# Altium project IPG.PrjPcb (part 1 of 13)
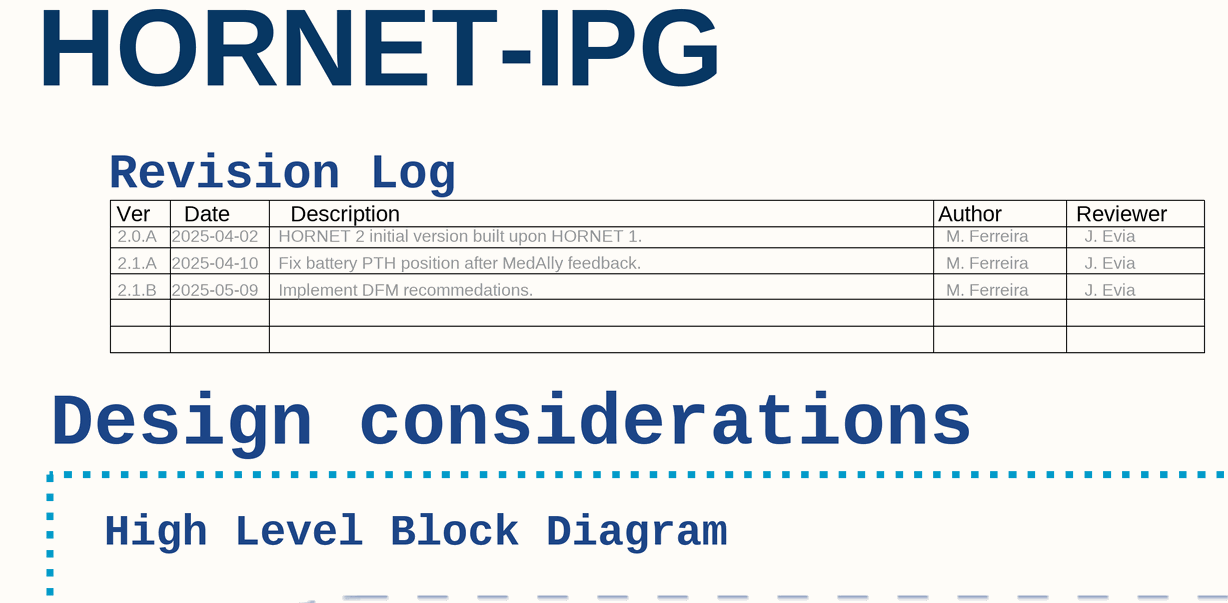
[diagram p0: 01-Cover.SchDoc, top left]
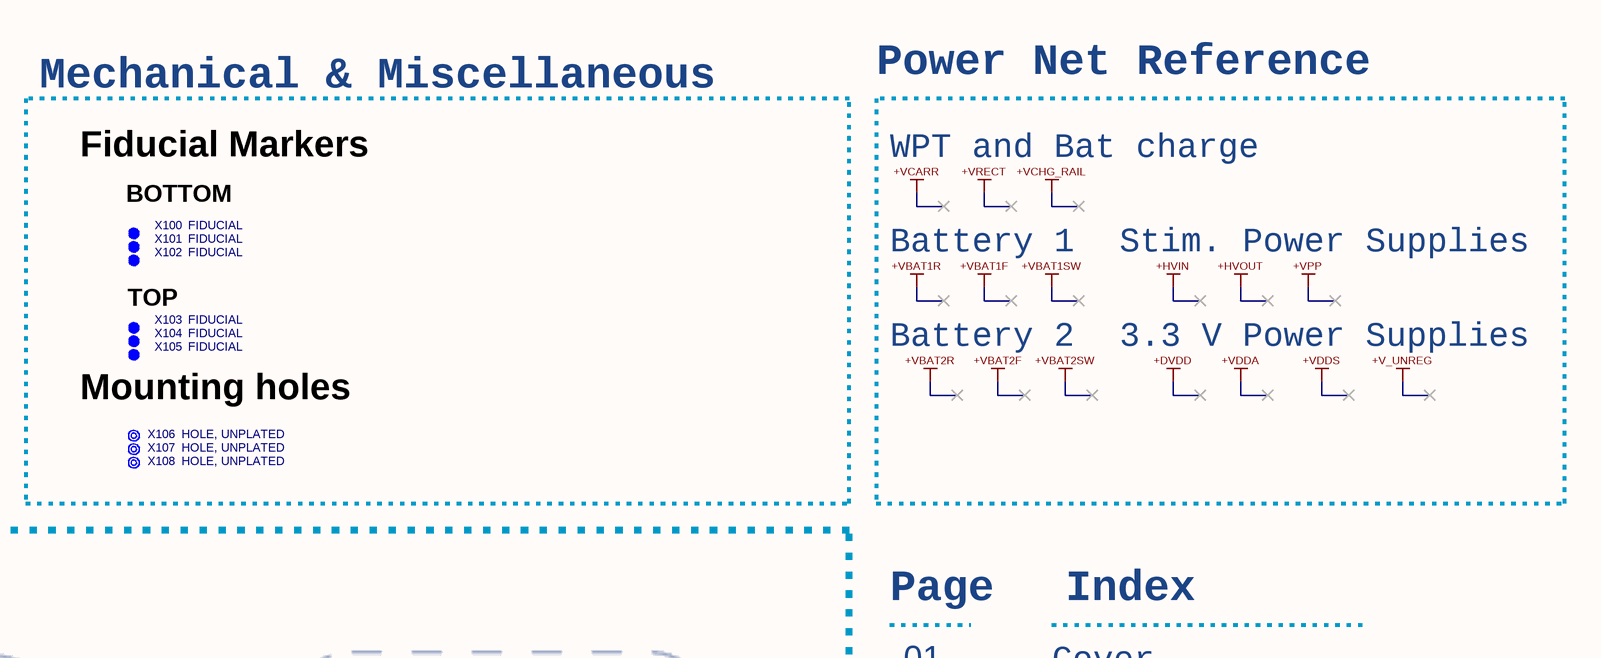
[diagram p1: 01-Cover.SchDoc, top right]
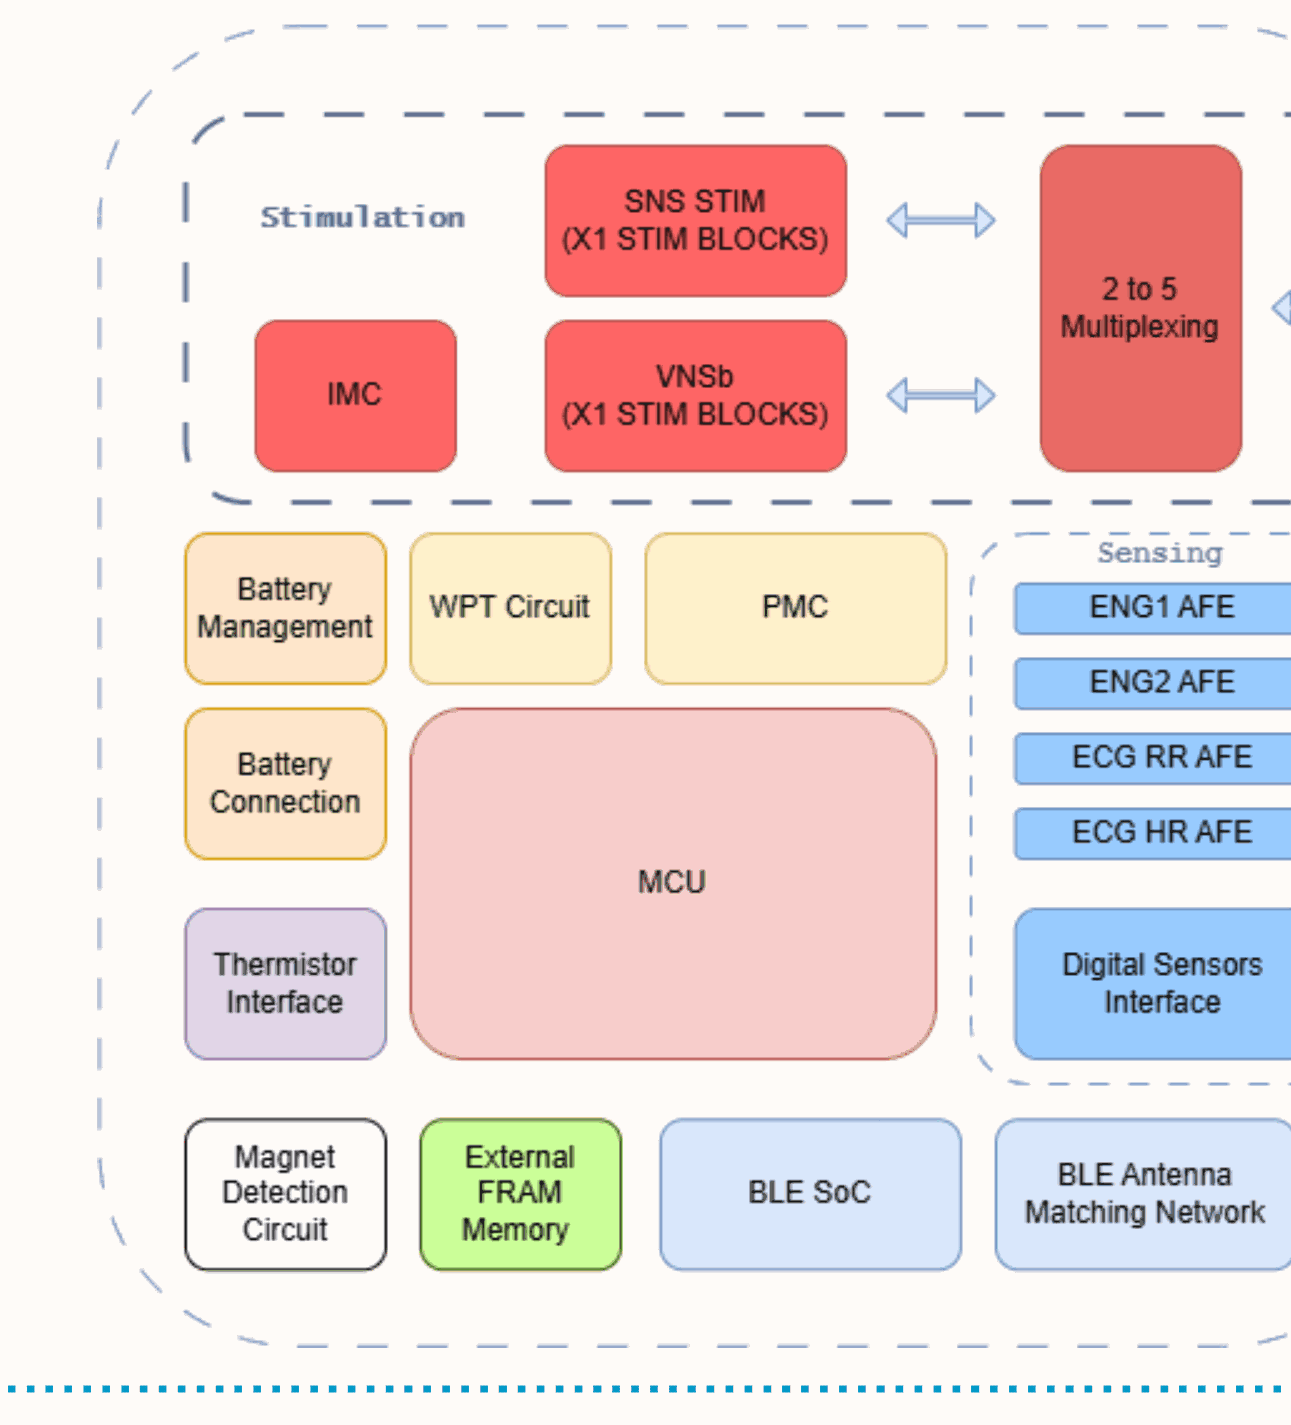
[diagram p2: 01-Cover.SchDoc, bottom left]
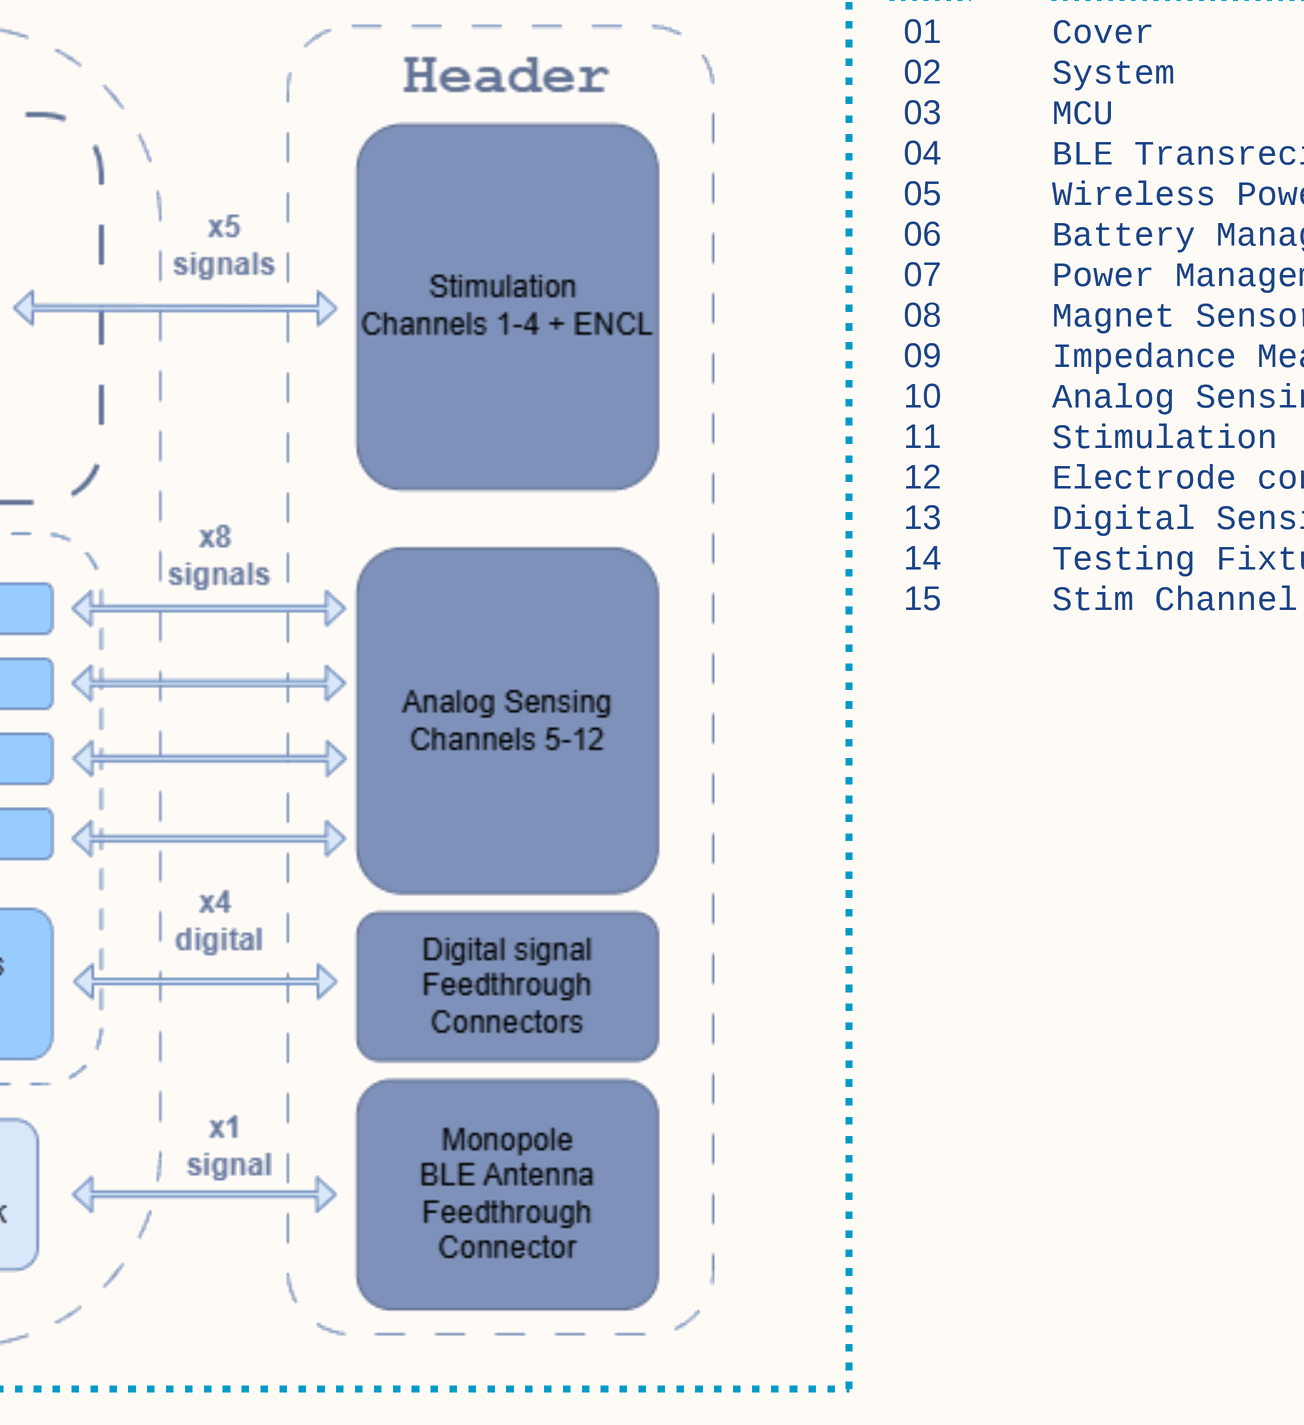
[diagram p3: 01-Cover.SchDoc, bottom right]
15 sheets, 726 parts. Net scope: flat (ports and power ports of the same name join across sheets).
Board files: IPG_Rigid.PcbDoc, IPG.PcbDoc
Sheets:
  01-Cover.SchDoc
    U_System = 02-System.SchDoc
      Battery Management = 06-BatteryManagement.SchDoc
      BLE = 04-BLE.SchDoc
      Electrodes = 12-Electrodes.SchDoc
      IMC = 09-IMC.SchDoc
      Magnet Sensor = 08-MagnetSensor.SchDoc
      STM32 MCU = 03-MCU.SchDoc
      Power Management = 07-PowerManagement.SchDoc
      Sensing = 10-Sensing.SchDoc
      Stimulation = 11-Stimulation.SchDoc
      WPT = 05-WPT.SchDoc
      Digital = 13-Digital.SchDoc
      Test Fixture = 14-TestFixture.SchDoc
      Stim. CH Selection = 15-StimChannelSelection.SchDoc

## Sheet 01-Cover.SchDoc: Cover Page
size A2; DocumentNumber: 1; SheetNumber: 1; SheetTotal: 15

### Parts
X100  FIDUCIAL  [Fid_IPC-7351B]  (no BOM)
X101  FIDUCIAL  [Fid_IPC-7351B]  (no BOM)
X102  FIDUCIAL  [Fid_IPC-7351B]  (no BOM)
X103  FIDUCIAL  [Fid_IPC-7351B]  (no BOM)
X104  FIDUCIAL  [Fid_IPC-7351B]  (no BOM)
X105  FIDUCIAL  [Fid_IPC-7351B]  (no BOM)
X106  HOLE, UNPLATED  [HOLE_UNPLATED_3.5MM]  (no BOM)
X107  HOLE, UNPLATED  [HOLE_UNPLATED_3.5MM]  (no BOM)
X108  HOLE, UNPLATED  [HOLE_UNPLATED_3.5MM]  (no BOM)

### Sub-sheets
U_System = 02-System.SchDoc: no entries

### Notes on the sheet
- Power Net Reference
- Mechanical & Miscellaneous
- HORNET-IPG
- Fiducial Markers
- BOTTOM
- WPT and Bat charge
- Revision Log
- Ver
- Date
- Description
- Author
- Reviewer
- Battery 1
- Stim. Power Supplies
- 2.0.A
- 2.1.A
- 2.1.B
- 2025-04-02
- 2025-04-10
- 2025-05-09
- HORNET 2 initial version built upon HORNET 1.
- Fix battery PTH position after MedAlly feedback.
- Implement DFM recommedations.
- M. Ferreira
- J. Evia
- TOP
- Battery 2
- 3.3 V Power Supplies
- (near X105) Mounting holes
- Design considerations
- High Level Block Diagram
- Page
- Index
- 01
- Cover
- 02
- 03
- System
- MCU
- 04
- BLE Transreciver
- 05
- 06
- Wireless Power Transfer
- Battery Management
- 07
- 08
- Power Management
- Magnet Sensor
- 09
- Impedance Meas. circuit
- 10
- 11
- Analog Sensing
- Stimulation
- 12
- 13
- Electrode connections
- Digital Sensing
- 14
- Testing Fixture
- 15
- Stim Channel Selection
- Project:
- Schematic:
- Design by:
- Date:
- Ver:
- .
- Comments:
- Reviewed by:

### Library data of the parts
X100-X105 = FIDUCIAL: FIDUCIAL_MARK; Manufacturer PN: FIDUCIAL; Status: *; Review: *
X106-X108 = HOLE_UNPLATED: Status: *; Review: *

## Sheet 02-System.SchDoc: System Block Diagram
size A2; DocumentNumber: 2; SheetNumber: 2; SheetTotal: 15
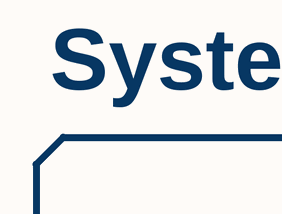
[diagram p4: 02-System.SchDoc, top left]
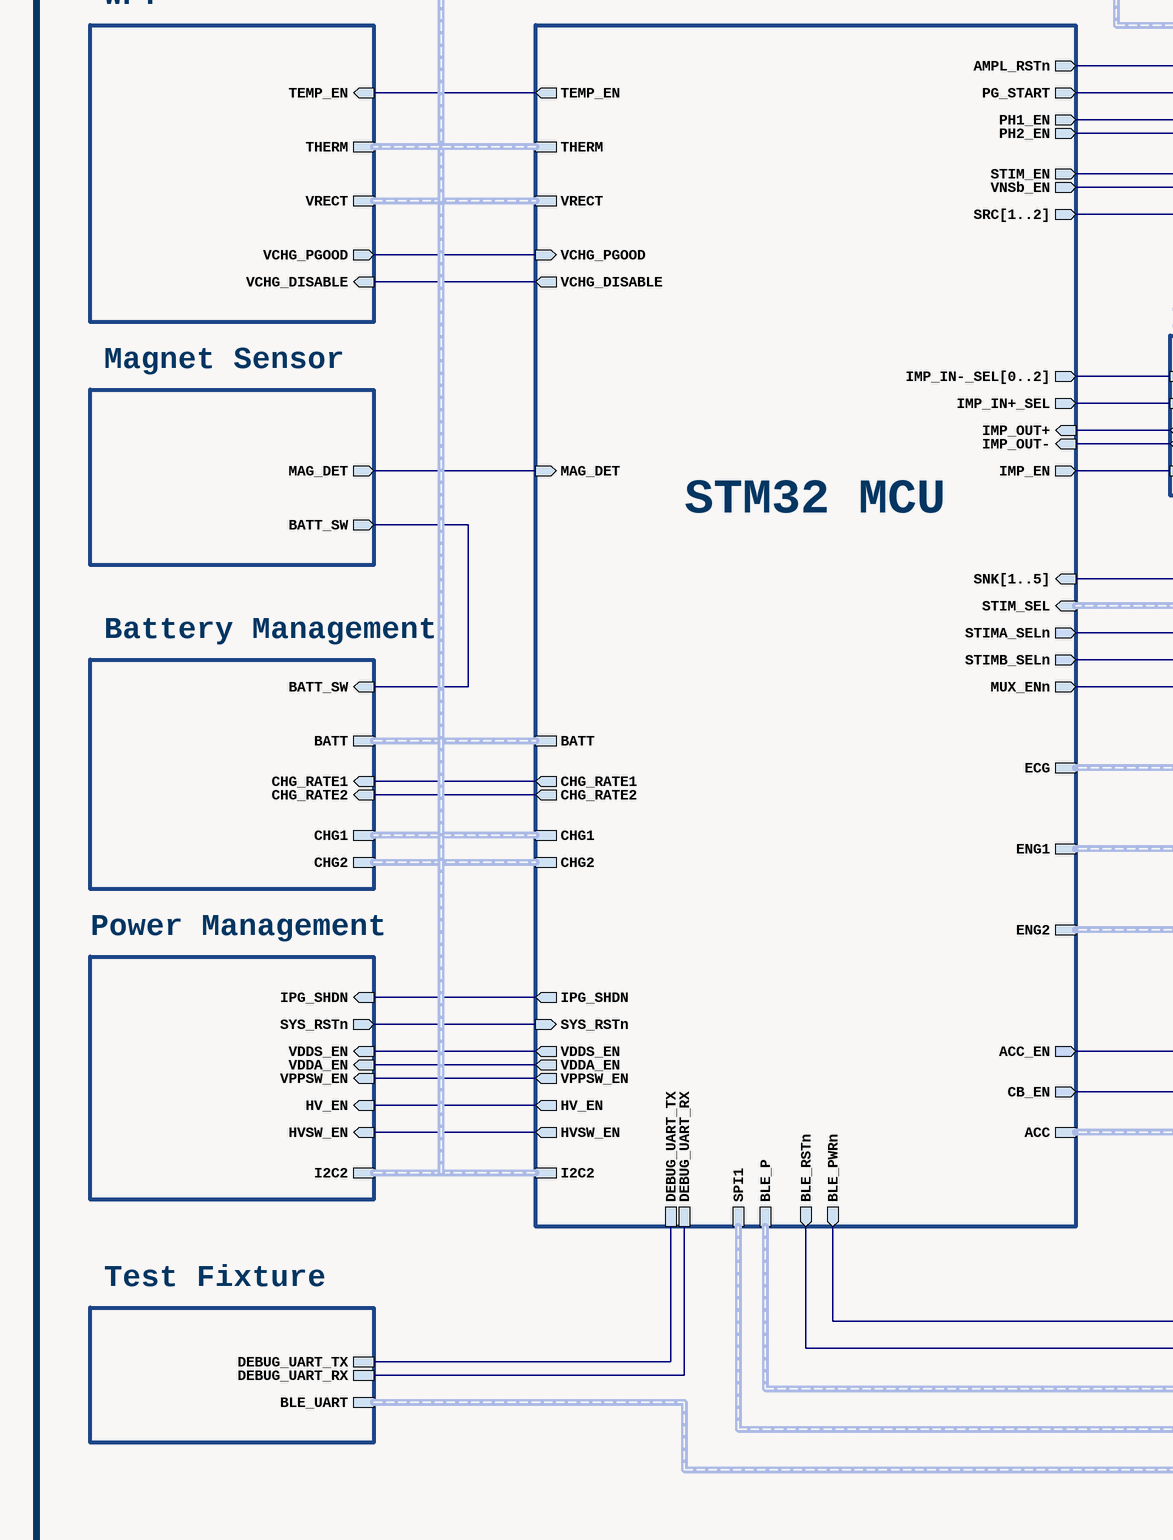
[diagram p5: 02-System.SchDoc, bottom left]
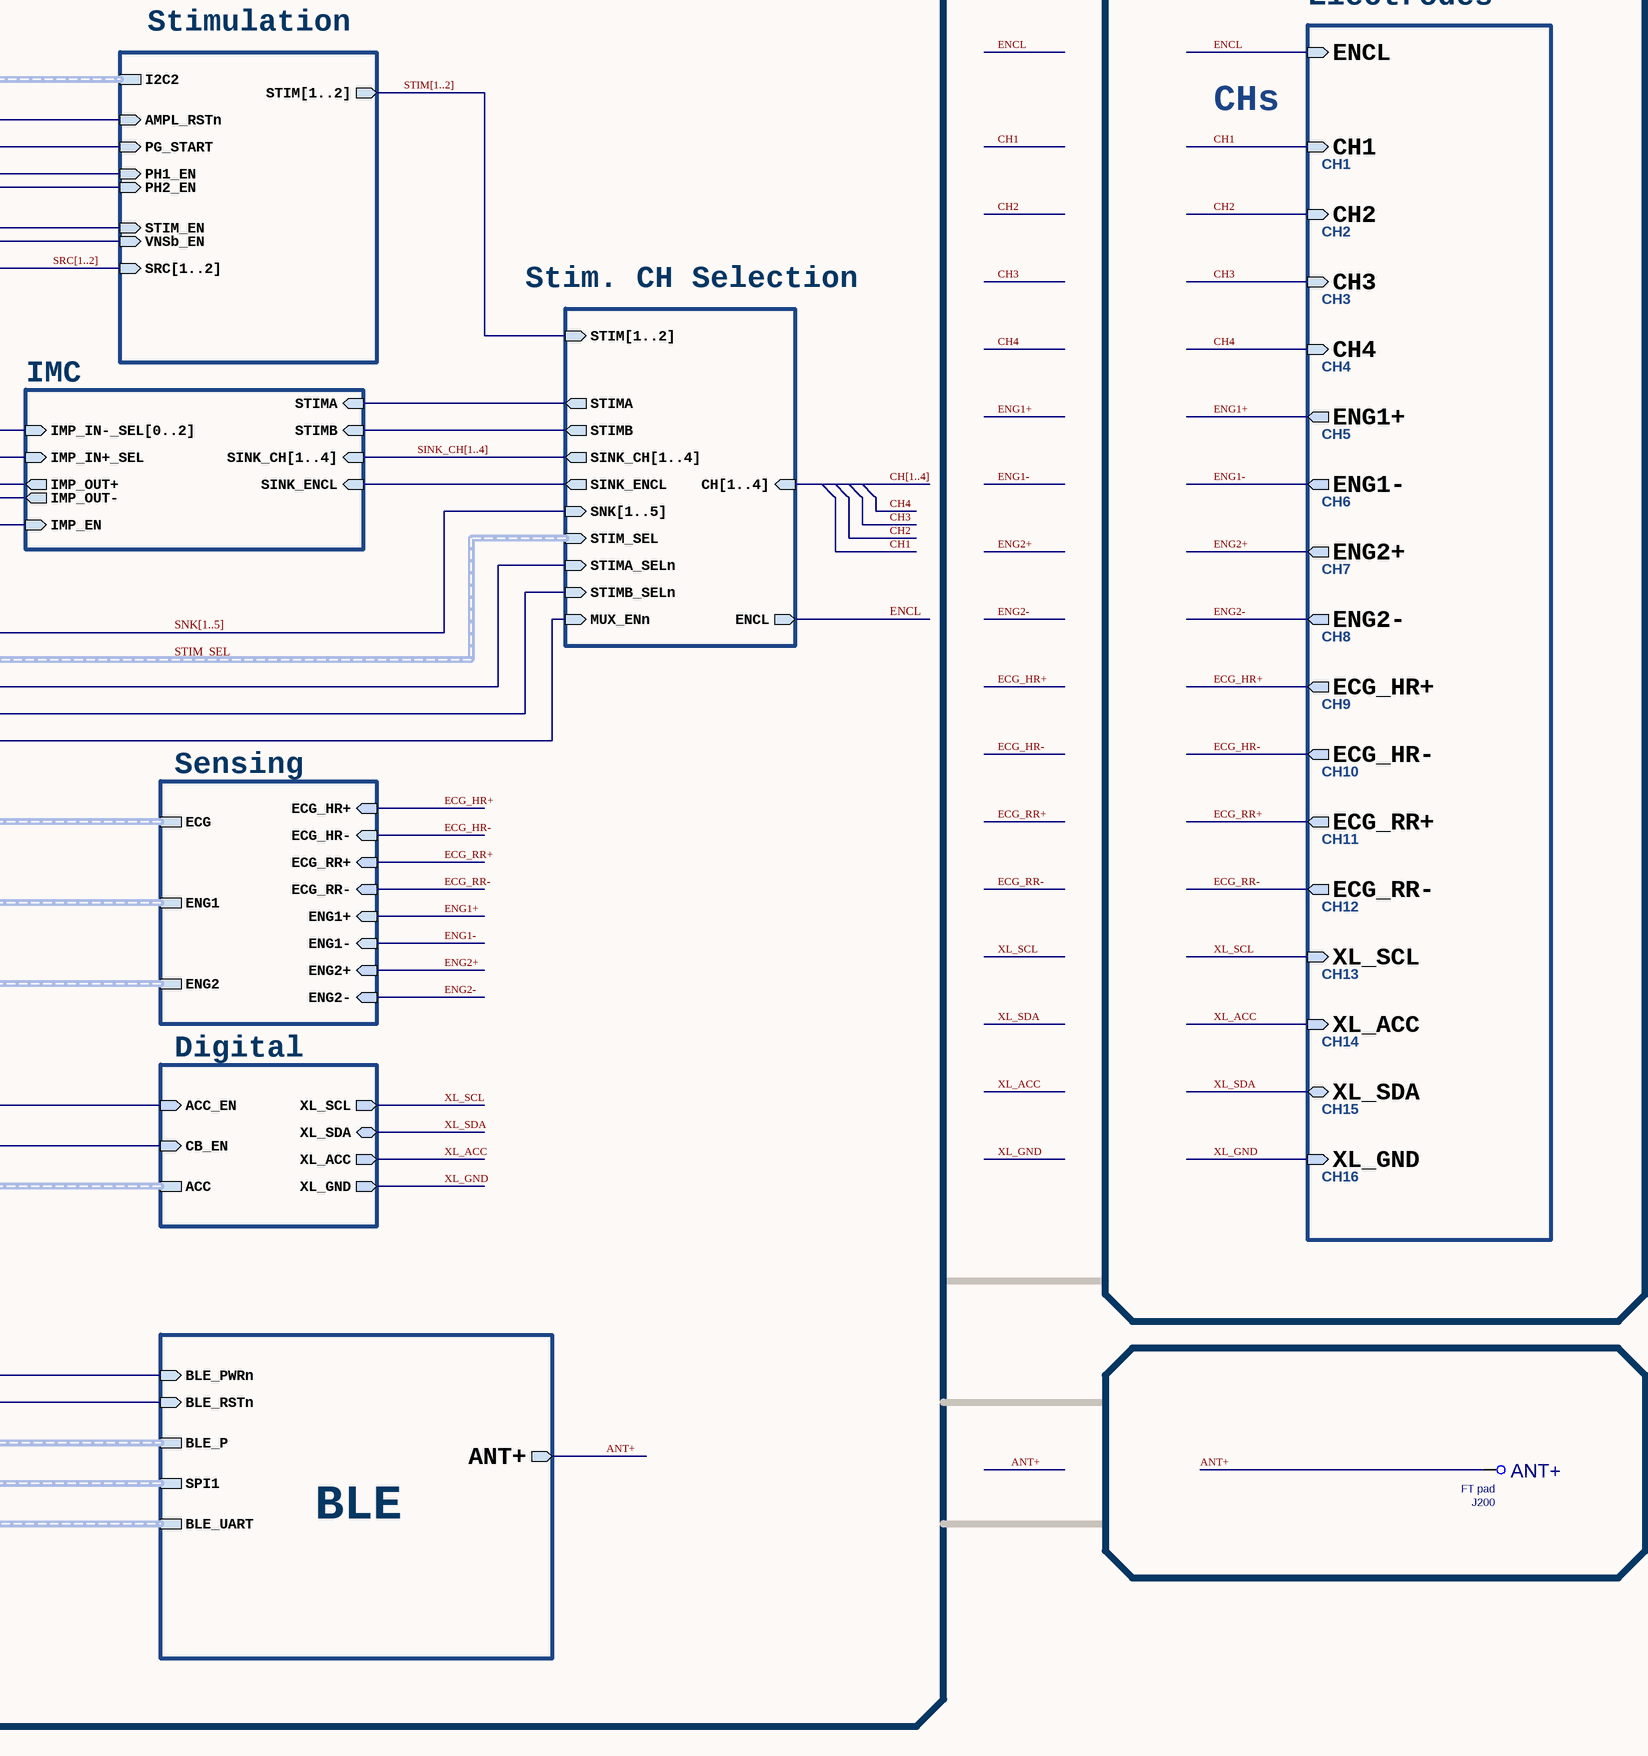
[diagram p6: 02-System.SchDoc, bottom right]

### Parts
J200  value FT pad  [FEEDHOLE_20mil]  (hidden comment: THPAD_20m)  (no BOM)

### Blocks framed on the sheet
ANT+: J200

### Sub-sheets
Battery Management = 06-BatteryManagement.SchDoc: CHG_RATE1 (in), CHG_RATE2 (in), BATT_SW (in), CHG1 (harness CHG_CTRL), CHG2 (harness CHG_CTRL), BATT (harness BATT)
BLE = 04-BLE.SchDoc: BLE_RSTn (in), BLE_PWRn (in), BLE_P (harness BLE PINS), ANT+ (out), SPI1 (harness BLE_SPI), BLE_UART (harness UART)
Digital = 13-Digital.SchDoc: ACC_EN (in), CB_EN (in), ACC (harness I2C), XL_SCL (out), XL_SDA (bidir), XL_ACC (out), XL_GND (out)
Electrodes = 12-Electrodes.SchDoc: CH1 (in), ENCL (in), ENG1+ (out), ENG2+ (out), ENG1- (out), ENG2- (out), ECG_HR+ (out), ECG_RR+ (out), ECG_HR- (out), ECG_RR- (out), XL_SCL (in), XL_SDA (bidir), XL_ACC (in), XL_GND (in), CH2 (in), CH3 (in), CH4 (in)
IMC = 09-IMC.SchDoc: IMP_EN (in), SINK_CH[1..4] (in), SINK_ENCL (in), IMP_IN-_SEL[0..2] (in), IMP_IN+_SEL (in), IMP_OUT- (out), IMP_OUT+ (out), STIMA (in), STIMB (in)
Magnet Sensor = 08-MagnetSensor.SchDoc: MAG_DET (out), BATT_SW (out)
Power Management = 07-PowerManagement.SchDoc: IPG_SHDN (in), SYS_RSTn (out), HVSW_EN (in), HV_EN (in), VPPSW_EN (in), VDDS_EN (in), VDDA_EN (in), I2C2 (harness I2C)
Sensing = 10-Sensing.SchDoc: ENG1+ (in), ENG1- (in), ECG_HR- (in), ENG1 (harness EMG), ECG (harness ECG), ECG_HR+ (in), ENG2 (harness EMG), ECG_RR+ (in), ECG_RR- (in), ENG2+ (in), ENG2- (in)
Stim. CH Selection = 15-StimChannelSelection.SchDoc: STIM[1..2] (in), CH[1..4] (in), ENCL (out), SNK[1..5] (in), STIM_SEL (in, harness STIM_SEL), MUX_ENn (in), STIMB_SELn (in), STIMA_SELn (in), SINK_CH[1..4] (out), SINK_ENCL (out), STIMA (out), STIMB (out)
Stimulation = 11-Stimulation.SchDoc: PG_START (in), AMPL_RSTn (in), PH1_EN (in), PH2_EN (in), STIM_EN (in), SRC[1..2] (in), STIM[1..2] (out), I2C2 (harness I2C), VNSb_EN (in)
STM32 MCU = 03-MCU.SchDoc: IMP_EN (out), SYS_RSTn (in), BLE_P (harness BLE PINS), MAG_DET (in), BLE_RSTn (out), BLE_PWRn (out), BATT (harness BATT), VPPSW_EN (out), HV_EN (out), CHG1 (harness CHG_CTRL), HVSW_EN (out), IPG_SHDN (out), CHG_RATE2 (out), CHG_RATE1 (out), CHG2 (harness CHG_CTRL), ECG (harness ECG), ENG1 (harness EMG), SRC[1..2] (out), VCHG_PGOOD (in), PH2_EN (out), PH1_EN (out), AMPL_RSTn (out), THERM (harness THERMAL CTRL), STIM_EN (out), PG_START (out), TEMP_EN (out), VDDA_EN (out), VDDS_EN (out), ENG2 (harness EMG), ACC_EN (out), CB_EN (out), ACC (harness I2C), SPI1 (harness BLE_SPI), DEBUG_UART_TX, DEBUG_UART_RX, I2C2 (harness I2C), VRECT (harness VRECT), STIM_SEL (in, harness STIM_SEL), SNK[1..5] (in), MUX_ENn (out), STIMB_SELn (out), STIMA_SELn (out), IMP_IN-_SEL[0..2] (out), IMP_IN+_SEL (out), IMP_OUT- (in), IMP_OUT+ (in), VNSb_EN (out), VCHG_DISABLE (out)
Test Fixture = 14-TestFixture.SchDoc: DEBUG_UART_TX, DEBUG_UART_RX, BLE_UART (harness UART)
WPT = 05-WPT.SchDoc: VCHG_PGOOD (out), TEMP_EN (in), THERM (harness THERMAL CTRL), VRECT (harness VRECT), VCHG_DISABLE (in)

### Nets
ANT+: J200.1 ; sheet BLE/ANT+
CH1: sheet Electrodes/CH1
CH2: sheet Electrodes/CH2
CH3: sheet Electrodes/CH3
CH4: sheet Electrodes/CH4
ECG_HR+: sheet Electrodes/ECG_HR+, sheet Sensing/ECG_HR+
ECG_HR-: sheet Electrodes/ECG_HR-, sheet Sensing/ECG_HR-
ECG_RR+: sheet Electrodes/ECG_RR+, sheet Sensing/ECG_RR+
ECG_RR-: sheet Electrodes/ECG_RR-, sheet Sensing/ECG_RR-
ENCL: sheet Electrodes/ENCL, sheet Stim. CH Selection/ENCL
ENG1+: sheet Electrodes/ENG1+, sheet Sensing/ENG1+
ENG1-: sheet Electrodes/ENG1-, sheet Sensing/ENG1-
ENG2+: sheet Electrodes/ENG2+, sheet Sensing/ENG2+
ENG2-: sheet Electrodes/ENG2-, sheet Sensing/ENG2-
XL_ACC: sheet Electrodes/XL_ACC, sheet Digital/XL_ACC
XL_GND: sheet Electrodes/XL_GND, sheet Digital/XL_GND
XL_SCL: sheet Electrodes/XL_SCL, sheet Digital/XL_SCL
XL_SDA: sheet Electrodes/XL_SDA, sheet Digital/XL_SDA
(unnamed): sheet Battery Management/CHG_RATE1, sheet STM32 MCU/CHG_RATE1
(unnamed): sheet Battery Management/CHG_RATE2, sheet STM32 MCU/CHG_RATE2
(unnamed): sheet Battery Management/BATT_SW, sheet Magnet Sensor/BATT_SW
(unnamed): sheet BLE/BLE_RSTn, sheet STM32 MCU/BLE_RSTn
(unnamed): sheet BLE/BLE_PWRn, sheet STM32 MCU/BLE_PWRn
(unnamed): sheet IMC/IMP_EN, sheet STM32 MCU/IMP_EN
(unnamed): sheet IMC/SINK_ENCL, sheet Stim. CH Selection/SINK_ENCL
(unnamed): sheet IMC/IMP_IN+_SEL, sheet STM32 MCU/IMP_IN+_SEL
(unnamed): sheet IMC/IMP_OUT-, sheet STM32 MCU/IMP_OUT-
(unnamed): sheet IMC/IMP_OUT+, sheet STM32 MCU/IMP_OUT+
(unnamed): sheet IMC/STIMA, sheet Stim. CH Selection/STIMA
(unnamed): sheet IMC/STIMB, sheet Stim. CH Selection/STIMB
(unnamed): sheet Magnet Sensor/MAG_DET, sheet STM32 MCU/MAG_DET
(unnamed): sheet STM32 MCU/SYS_RSTn, sheet Power Management/SYS_RSTn
(unnamed): sheet STM32 MCU/VPPSW_EN, sheet Power Management/VPPSW_EN
(unnamed): sheet STM32 MCU/HV_EN, sheet Power Management/HV_EN
(unnamed): sheet STM32 MCU/HVSW_EN, sheet Power Management/HVSW_EN
(unnamed): sheet STM32 MCU/IPG_SHDN, sheet Power Management/IPG_SHDN
(unnamed): sheet STM32 MCU/VCHG_PGOOD, sheet WPT/VCHG_PGOOD
(unnamed): sheet STM32 MCU/PH2_EN, sheet Stimulation/PH2_EN
(unnamed): sheet STM32 MCU/PH1_EN, sheet Stimulation/PH1_EN
(unnamed): sheet STM32 MCU/AMPL_RSTn, sheet Stimulation/AMPL_RSTn
(unnamed): sheet STM32 MCU/STIM_EN, sheet Stimulation/STIM_EN
(unnamed): sheet STM32 MCU/PG_START, sheet Stimulation/PG_START
(unnamed): sheet STM32 MCU/TEMP_EN, sheet WPT/TEMP_EN
(unnamed): sheet STM32 MCU/VDDA_EN, sheet Power Management/VDDA_EN
(unnamed): sheet STM32 MCU/VDDS_EN, sheet Power Management/VDDS_EN
(unnamed): sheet STM32 MCU/ACC_EN, sheet Digital/ACC_EN
(unnamed): sheet STM32 MCU/CB_EN, sheet Digital/CB_EN
(unnamed): sheet STM32 MCU/DEBUG_UART_TX, sheet Test Fixture/DEBUG_UART_TX
(unnamed): sheet STM32 MCU/DEBUG_UART_RX, sheet Test Fixture/DEBUG_UART_RX
(unnamed): sheet STM32 MCU/MUX_ENn, sheet Stim. CH Selection/MUX_ENn
(unnamed): sheet STM32 MCU/STIMB_SELn, sheet Stim. CH Selection/STIMB_SELn
(unnamed): sheet STM32 MCU/STIMA_SELn, sheet Stim. CH Selection/STIMA_SELn
(unnamed): sheet STM32 MCU/VNSb_EN, sheet Stimulation/VNSb_EN
(unnamed): sheet STM32 MCU/VCHG_DISABLE, sheet WPT/VCHG_DISABLE

### Buses and harness runs
bus CH[1..4] = sheet Stim. CH Selection/CH[1..4]
bus sheet IMC/IMP_IN-_SEL[0..2] = sheet STM32 MCU/IMP_IN-_SEL[0..2]
bus SINK_CH[1..4] = sheet IMC/SINK_CH[1..4] = sheet Stim. CH Selection/SINK_CH[1..4]
bus SNK[1..5] = sheet Stim. CH Selection/SNK[1..5] = sheet STM32 MCU/SNK[1..5]
bus SRC[1..2] = sheet Stimulation/SRC[1..2] = sheet STM32 MCU/SRC[1..2]
bus STIM[1..2] = sheet Stim. CH Selection/STIM[1..2] = sheet Stimulation/STIM[1..2]
harness sheet Battery Management/BATT = sheet STM32 MCU/BATT
harness sheet Battery Management/CHG1 = sheet STM32 MCU/CHG1
harness sheet Battery Management/CHG2 = sheet STM32 MCU/CHG2
harness sheet BLE/BLE_P = sheet STM32 MCU/BLE_P
harness sheet BLE/BLE_UART = sheet Test Fixture/BLE_UART
harness sheet BLE/SPI1 = sheet STM32 MCU/SPI1
harness sheet Digital/ACC = sheet STM32 MCU/ACC
harness sheet Power Management/I2C2 = sheet Stimulation/I2C2 = sheet STM32 MCU/I2C2
harness sheet Sensing/ECG = sheet STM32 MCU/ECG
harness sheet Sensing/ENG1 = sheet STM32 MCU/ENG1
harness sheet Sensing/ENG2 = sheet STM32 MCU/ENG2
harness sheet STM32 MCU/THERM = sheet WPT/THERM
harness sheet STM32 MCU/VRECT = sheet WPT/VRECT
harness STIM_SEL = sheet Stim. CH Selection/STIM_SEL = sheet STM32 MCU/STIM_SEL

### Notes on the sheet
- System Block Diagram
- CHs
- CH1
- CH2
- CH3
- CH4
- CH5
- CH6
- CH7
- CH8
- CH9
- CH10
- CH11
- CH12
- CH13
- CH14
- CH15
- CH16
- Project:
- Schematic:
- Design by:
- Date:
- Ver:
- .
- Comments:
- Reviewed by:

### Library data of the parts
J200 = HOLE_20m: FT pad, Thru-hole, 20 mil hole; PCB Footprint: TBD; Category: FT pad; Length (mm): TBD; Manufacturer: N/A; Manufacturer PN: N/A; Medical Grade MFR: N/A; Medical Grade MFR PN: N/A; Rating: N/A; Thickness (mm): N/A; Width (mm): TBD; Package Description: FT pad; Status: *; Review: *